# Altium project STM_BLUEPILL.PrjPcb (part 2 of 2)

## Sheet [04] - MICROCONTROLLER.SchDoc
size A3; DocumentNumber: 4; SheetNumber: 4; SheetTotal: 7
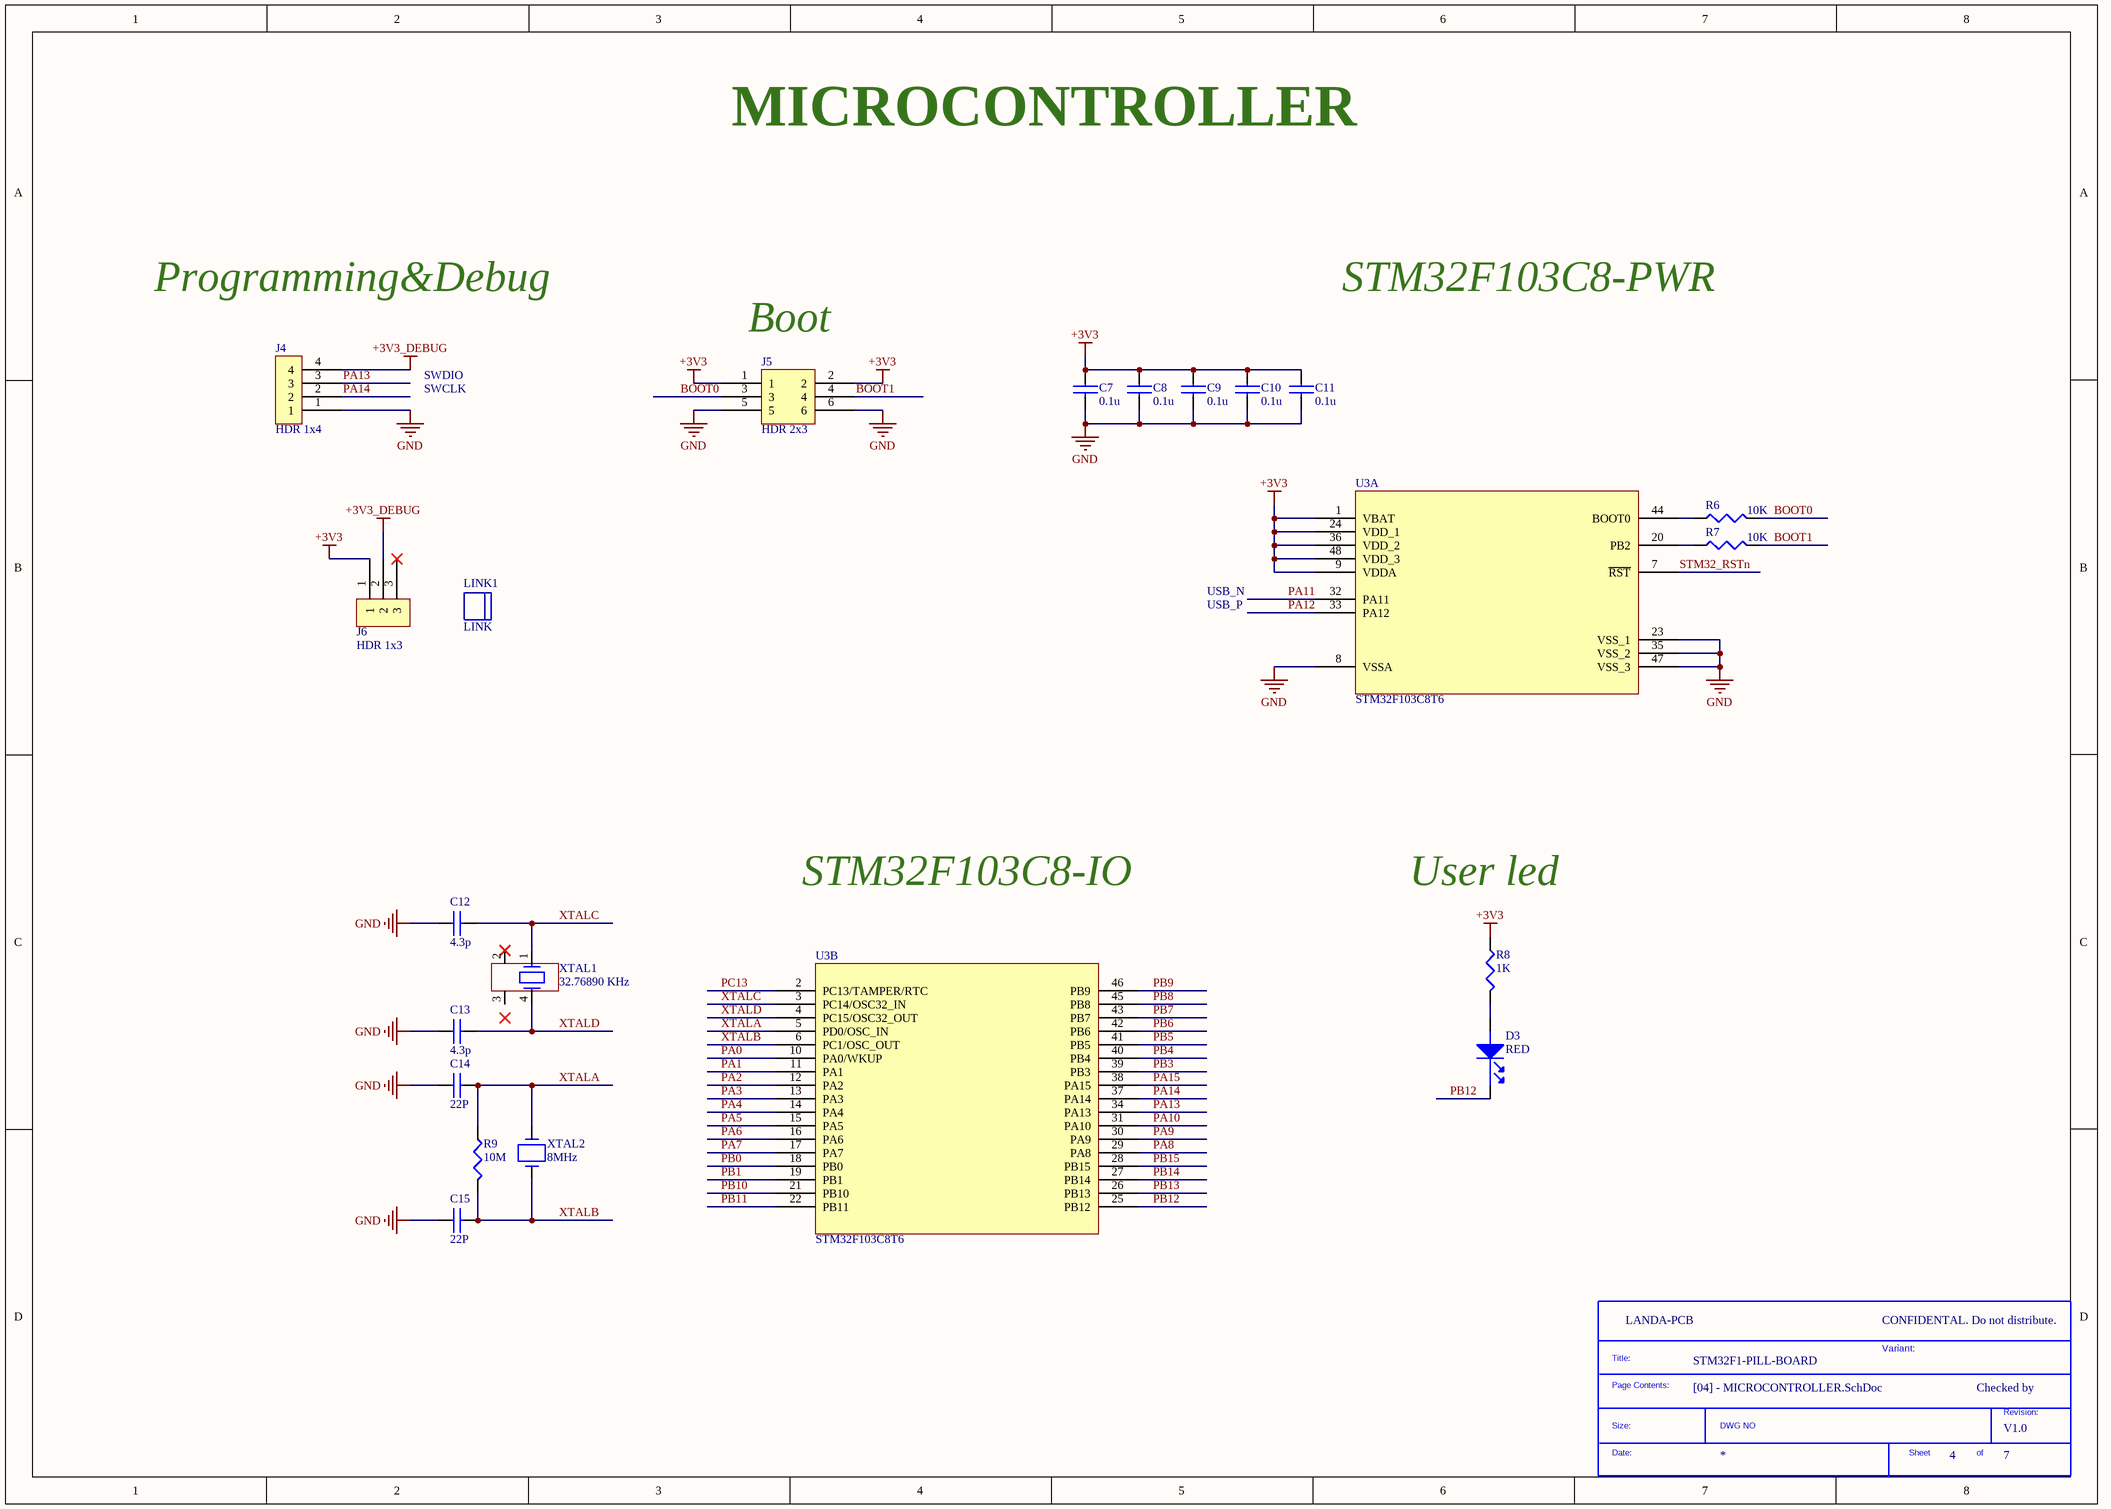
[diagram p5: [04] - MICROCONTROLLER.SchDoc]

### Parts
(Parts that share a designator on the sheet are numbered #1, #2 ... from top to bottom, then left to right.)
*#6  SDTitleBlock  (value not drawn)  (graphical)
C7  0.1u  [C0805]
C8  0.1u  [C0805]
C9  0.1u  [C0805]
C10  0.1u  [C0805]
C11  0.1u  [C0805]
C12  4.3p  [C0805]
C13  4.3p  [C0805]
C14  22P  [C0805]
C15  22P  [C0805]
D3  RED  [LED-0805]
J4  HDR 1x4  [HDR_1x4_2.54MM]
J5  HDR 2x3  [HDR_2X3_2.54MM]
J6  HDR 1x3  [Hdr_1x3_2.54mm]
LINK1  LINK  (mechanical)
R6  10K  [R0805]
R7  10K  [R0805]
R8  1K  [R0805]
R9  10M  [R0805]
U3  STM32F103C8T6  [LQFP-48]  (parts A,B of 2)
XTAL1  32.76890 KHz  [XTAL_ABS25-32.768KHZ-6-T]
XTAL2  8MHz  [XTAL_11.4mmx4.9mm]

### Nets
+3V3: C7.1 C8.1 C9.1 C10.1 C11.1 J5.1 J5.2 J6.1 R8.1 U3.1(VBAT) U3.9(VDDA) U3.24(VDD_1) U3.36(VDD_2) U3.48(VDD_3)
+3V3_DEBUG: J4.4 J6.2
GND: C7.2 C8.2 C9.2 C10.2 C11.2 C12.1 C13.1 C14.1 C15.1 J4.1 J5.5 J5.6 U3.8(VSSA) U3.23(VSS_1) U3.35(VSS_2) U3.47(VSS_3)
BOOT0: J5.3 R6.2
BOOT1: J5.4 R7.2
PA0: U3.10(PA0/WKUP)
PA1: U3.11(PA1)
PA2: U3.12(PA2)
PA3: U3.13(PA3)
PA4: U3.14(PA4)
PA5: U3.15(PA5)
PA6: U3.16(PA6)
PA7: U3.17(PA7)
PA8: U3.29(PA8)
PA9: U3.30(PA9)
PA10: U3.31(PA10)
PA11: U3.32(PA11)
PA12: U3.33(PA12)
PA13: J4.3 U3.34(PA13)
PA14: J4.2 U3.37(PA14)
PA15: U3.38(PA15)
PB0: U3.18(PB0)
PB1: U3.19(PB1)
PB3: U3.39(PB3)
PB4: U3.40(PB4)
PB5: U3.41(PB5)
PB6: U3.42(PB6)
PB7: U3.43(PB7)
PB8: U3.45(PB8)
PB9: U3.46(PB9)
PB10: U3.21(PB10)
PB11: U3.22(PB11)
PB12: D3.1(cathode) U3.25(PB12)
PB13: U3.26(PB13)
PB14: U3.27(PB14)
PB15: U3.28(PB15)
PC13: U3.2(PC13/TAMPER/RTC)
STM32_RSTn: U3.7(~{RST})
XTALA: C14.2 R9.1 U3.5(PD0/OSC_IN) XTAL2.1
XTALB: C15.2 R9.2 U3.6(PC1/OSC_OUT) XTAL2.2
XTALC: C12.2 U3.3(PC14/OSC32_IN) XTAL1.1
XTALD: C13.2 U3.4(PC15/OSC32_OUT) XTAL1.4
NetD3_2: D3.2(ANODE) R8.2
NetR6_1: R6.1 U3.44(BOOT0)
NetR7_1: R7.1 U3.20(PB2)

Not connected (* = marked no-connect by the designer): J6 3*; XTAL1 2* 3

### Notes on the sheet
- MICROCONTROLLER
- Programming&Debug
- STM32F103C8-PWR
- SWDIO
- (near J5) Boot
- SWCLK
- USB_N
- USB_P
- STM32F103C8-IO
- User led
- CONFIDENTAL. Do not distribute.
- CLOCKS (CPU & PCIE)
- Variant:
- Checked by
- (in symbol SDTitleBlock) Title:; Page Contents:; Revision:; Size:; DWG NO; Date:; Sheet; of

### Library data of the parts
C7-C11 = C2012X7R1H104K085AA: CAP CER 0.1UF 50V 10% X7R 0805; Manufacturer: TDK; Dielectric Material: Ceramic; Capacitance: 100nF; Supplier 1: Digi-Key; Manufacturer Part Number: C2012X7R1H104K085AA; Stock 1: 151003; Pricing 1: 1 = 0.17000, 10 = 0.11900, 100 = 0.05610, 500 = 0.03936, 1000 = 0.03258 (USD); RoHS: Yes; Mount: Surface Mount; Case/Package: 0805; Number of Pins: 2; Weight: 0.000194oz; Case Code (Metric): 2012; Case Code (Imperial): 0805; Min Operating Temperature: -55°C; Max Operating Temperature: 125°C; Tolerance: 10%; Dielectric: X7R; Termination: SMD/SMT; Voltage Rating: 50V; Packaging: Tape and Reel; Voltage Rating (DC): 50V; Composition: Ceramic; Voltage: 50V; Package Quantity: 1; Length: 2mm; Height: 0.85mm; Depth: 1.25mm; Thickness: 0.037inch; Width: 0.049inch; Radiation Hardening: No; Lead Free: Lead Free; REACH SVHC: No SVHC; ComponentLink1URL: https://datasheet.ciiva.com/11788/0900766b80c1bb00-11788128.pdf?src-supplier=RSComponents; ComponentLink1Description: https://datasheet.ciiva.com/11788/0900766b80c1bb00-11788128.pdf?src-supplier=RSComponents; ComponentLink2URL: https://datasheet.ciiva.com/6250/tdkmlcccaprange-6250821.pdf?src-supplier=Digi-Key; ComponentLink2Description: https://datasheet.ciiva.com/6250/tdkmlcccaprange-6250821.pdf?src-supplier=Digi-Key; ComponentLink3URL: https://datasheet.ciiva.com/24191/e412-c-24191447.pdf?src-supplier=Future+Electronics; ComponentLink3Description: https://datasheet.ciiva.com/24191/e412-c-24191447.pdf?src-supplier=Future+Electronics; ComponentLink4URL: https://datasheet.ciiva.com/6250/tdkmlcccaprange-6250824.pdf?src-supplier=Digi-Key; ComponentLink4Description: https://datasheet.ciiva.com/6250/tdkmlcccaprange-6250824.pdf?src-supplier=Digi-Key; ComponentLink5URL: https://datasheet.ciiva.com/23803/1796654-23803035.pdf?src-supplier=Newark; ComponentLink5Description: https://datasheet.ciiva.com/23803/1796654-23803035.pdf?src-supplier=Newark; ComponentLink6URL: https://datasheet.ciiva.com/28602/1571323-28602204.pdf?src-supplier=Element14; ComponentLink6Description: https://datasheet.ciiva.com/28602/1571323-28602204.pdf?src-supplier=Element14; Supplier Part Number 1: 445-7534-1-ND
C12 C13 = 08055A4R3CAT2A: CAP CER 4.3PF 50V NP0 0805; Manufacturer: Kyocera AVX; Dielectric: C0G; Supplier 1: Mouser; Manufacturer Part Number: 08055A4R3CAT2A; Stock 1: 7147; Pricing 1: 1 = 0.24000, 10 = 0.16700, 100 = 0.09500, 500 = 0.06700, 1000 = 0.05800, 2000 = 0.04800 (USD); RoHS: Yes; Mount: Surface Mount; Case/Package: 0805; Case Code (Metric): 2012; Case Code (Imperial): 0805; Min Operating Temperature: -55°C; Max Operating Temperature: 125°C; Termination: SMD/SMT; Package Quantity: 4000; Capacitance: 4.3pF; Voltage Rating: 50V; Packaging: Tape and Reel; Voltage Rating (DC): 50V; Length: 2.01mm; Height: 0.94mm; Thickness: 0.037inch; Depth: 1.25mm; Width: 0.049inch; Radiation Hardening: No; ComponentLink1URL: https://datasheet.ciiva.com/11571/ccog-11571222.pdf?src-supplier=Avnet; ComponentLink1Description: https://datasheet.ciiva.com/11571/ccog-11571222.pdf?src-supplier=Avnet; ComponentLink2URL: https://datasheet.ciiva.com/204/ccog-204993.pdf?src-supplier=Digi-Key; ComponentLink2Description: https://datasheet.ciiva.com/204/ccog-204993.pdf?src-supplier=Digi-Key; Supplier Part Number 1: 581-08055A4R3CAT2A
C14 C15 = C0805C220J5GACTU: CAP CER 22pF 50VDC C0G ±5% 0805; Manufacturer: KEMET; Dielectric Material: Ceramic; Temperature Coefficient: 30ppm/°C; Voltage Rating: 50V; Supplier 1: Mouser; Manufacturer Part Number: C0805C220J5GACTU; Stock 1: 168597; Pricing 1: 1 = 0.10000, 10 = 0.06300, 100 = 0.03100, 500 = 0.02200, 1000 = 0.01700, 4000 = 0.01200 (USD); RoHS: Yes; Mount: PCB,Surface Mount; Case/Package: 0805; Weight: 0.000194oz; Case Code (Metric): 2012; Case Code (Imperial): 0805; Contact Plating: Tin,Matte; Contact Material: Tin; Min Operating Temperature: -55°C; Max Operating Temperature: 125°C; Dielectric: C0G; Packaging: Tape and Reel; Capacitance: 22pF; Tolerance: 5%; Package Quantity: 1; Voltage Rating (DC): 50V; Termination: SMD/SMT; Voltage: 50V; Length: 2mm; Height: 0.78mm; Width: 1.25mm; Thickness: 0.035inch; Depth: 1.25mm; Radiation Hardening: No; Lead Free: Lead Free; REACH SVHC: No SVHC; ComponentLink1URL: https://datasheet.ciiva.com/7842/1732694-7842250.pdf?src-supplier=Element14; ComponentLink1Description: https://datasheet.ciiva.com/7842/1732694-7842250.pdf?src-supplier=Element14; ComponentLink2URL: https://datasheet.ciiva.com/28668/1789732-28668761.pdf?src-supplier=Element14; ComponentLink2Description: https://datasheet.ciiva.com/28668/1789732-28668761.pdf?src-supplier=Element14; ComponentLink3URL: https://datasheet.ciiva.com/7842/1372242-7842570.pdf?src-supplier=Element14; ComponentLink3Description: https://datasheet.ciiva.com/7842/1372242-7842570.pdf?src-supplier=Element14; Supplier Part Number 1: 80-C0805C220J5G
D3 = LTST-C170EKT: LED RED 630NM 0805; Manufacturer: Vishay Lite-On; Lens Color: Colorless; Test Current: 10mA; Luminous Intensity: 2mcd; Viewing Angle: 130°; Forward Voltage: 2V; Dominant Wavelength: 621nm; Lens Transparency: Clear; Reverse Voltage: 5V; Number of Elements: 1; Power Dissipation: 100mW; Forward Current: 30mA; Lens Style: Diffused,Colorless,Rectangular,Clear; Supplier 1: Mouser; Manufacturer Part Number: LTST-C170EKT; Stock 1: 11147; Pricing 1: 1 = 0.33000, 10 = 0.18000, 100 = 0.08300, 1000 = 0.06100, 3000 = 0.05200, 9000 = 0.04700, 24000 = 0.04100, 45000 = 0.03800, 99000 = 0.03500 (USD); RoHS: Yes; Mount: Surface Mount; Case/Package: 0805; Number of Pins: 2; Color: Red; Case Code (Imperial): 0805; Case Code (Metric): 2012; Min Operating Temperature: -55°C; Max Operating Temperature: 85°C; Wavelength: 630nm; Packaging: Tape and Reel; Package Quantity: 1; Number of LEDs: 1; Illumination Color: Red; Power Rating: 100mW; Voltage: 5V; Length: 2mm; Height: 1.1mm; Width: 1.25mm; Depth: 1.25mm; Radiation Hardening: No; Lead Free: Lead Free; ComponentLink1URL: https://datasheet.ciiva.com/2110/ltst-c170ekt-2110099.pdf?src-supplier=Digi-Key; ComponentLink1Description: https://datasheet.ciiva.com/2110/ltst-c170ekt-2110099.pdf?src-supplier=Digi-Key; ComponentLink2URL: https://datasheet.ciiva.com/15117/getdatasheetpartid-147507-15117859.pdf?src-supplier=Verical; ComponentLink2Description: https://datasheet.ciiva.com/15117/getdatasheetpartid-147507-15117859.pdf?src-supplier=Verical; ComponentLink3URL: https://datasheet.ciiva.com/11775/0900766b80dc0277-11775641.pdf?src-supplier=RSComponents; ComponentLink3Description: https://datasheet.ciiva.com/11775/0900766b80dc0277-11775641.pdf?src-supplier=RSComponents; ComponentLink4URL: https://datasheet.ciiva.com/19482/1260314-19482330.pdf?src-supplier=Jameco; ComponentLink4Description: https://datasheet.ciiva.com/19482/1260314-19482330.pdf?src-supplier=Jameco; ComponentLink5URL: https://datasheet.ciiva.com/16202/lite-on20ltst-c170ekt-16202383.pdf?src-supplier=Future+Electronics; ComponentLink5Description: https://datasheet.ciiva.com/16202/lite-on20ltst-c170ekt-16202383.pdf?src-supplier=Future+Electronics; ComponentLink6URL: https://datasheet.ciiva.com/2110/ltst-c170ekt-2110100.pdf?src-supplier=Digi-Key; ComponentLink6Description: https://datasheet.ciiva.com/2110/ltst-c170ekt-2110100.pdf?src-supplier=Digi-Key; ComponentLink7URL: https://datasheet.ciiva.com/2110/ltst-c170ekt-2110101.pdf?src-supplier=Digi-Key; ComponentLink7Description: https://datasheet.ciiva.com/2110/ltst-c170ekt-2110101.pdf?src-supplier=Digi-Key; Supplier Part Number 1: 859-LTST-C170EKT
J4 = 68001-204HLF: CONN HEADER VERT 4POS 2.54MM; Manufacturer: Amphenol FCI; Current Rating: 3A; Voltage Rating: 1.5kV; Connector Type: Male Pin; Gender: Male; Number of Positions: 4; Insulation Resistance: 5GR; Contact Post Length: 3.05mm; Supplier 1: Digi-Key; Manufacturer Part Number: 68001-204HLF; Stock 1: 3842; Pricing 1: 1 = 0.38000, 10 = 0.35700, 100 = 0.25010, 500 = 0.21442, 1000 = 0.17868, 5000 = 0.15315, 10000 = 0.14294 (USD); RoHS: Yes; Mount: Through Hole; Color: Black; Contact Plating: Gold,GXT; Contact Material: Bronze; Housing Material: Thermoplastic; Min Operating Temperature: -65°C; Max Operating Temperature: 125°C; Package Quantity: 100; Number of Rows: 1; Packaging: Bulk; Contact Gender: Male; Termination: Solder; Number of Contacts: 4; Orientation: Straight; Pitch: 2.54mm; Contact Mating Length: 0.23inch; Radiation Hardening: No; Flammability Rating: UL94 V-0; ComponentLink1URL: https://datasheet.ciiva.com/5164/68000-274255-5164127.pdf?src-supplier=Mouser; ComponentLink1Description: https://datasheet.ciiva.com/5164/68000-274255-5164127.pdf?src-supplier=Mouser; ComponentLink2URL: https://datasheet.ciiva.com/726/68000-726529.pdf?src-supplier=Digi-Key; ComponentLink2Description: https://datasheet.ciiva.com/726/68000-726529.pdf?src-supplier=Digi-Key; Supplier Part Number 1: 609-3402-ND
J5 = 67997-106HLF: CONN HEADER 6POS .100 STR 30AU; Manufacturer: Amphenol FCI; Number of Contacts: 6; Insulation Resistance: 5GR; Max Voltage Rating (AC): 1.5kV; Gender: Male; Current Rating: 3A; Connector Type: Male Pin; Pitch: 2.54mm; Row Spacing: 0.1inch; Contact Post Length: 3.05mm; Supplier 1: Mouser; Manufacturer Part Number: 67997-106HLF; Stock 1: 1840; Pricing 1: 1 = 1.78000, 10 = 1.55000, 100 = 1.38000, 200 = 1.33000, 500 = 1.15000, 1000 = 0.94100 (USD); RoHS: Yes; Mount: Through Hole; Contact Plating: Gold,GXT; Housing Color: Black; Contact Material: Bronze; Color: Black; Housing Material: Thermoplastic; Min Operating Temperature: -65°C; Max Operating Temperature: 125°C; Termination: Through Hole; Number of Rows: 2; Orientation: Straight; Number of Positions: 6; Packaging: Bulk; Package Quantity: 100; Contact Gender: Male; Voltage Rating: 1.5kV; Length: 7.62mm; Contact Mating Length: 0.23inch; Depth: 4.83mm; Radiation Hardening: No; Lead Free: Lead Free; REACH SVHC: No SVHC; Flammability Rating: UL94 V-0; ComponentLink1URL: https://datasheet.ciiva.com/5153/67996-222463-5153820.pdf?src-supplier=Mouser; ComponentLink1Description: https://datasheet.ciiva.com/5153/67996-222463-5153820.pdf?src-supplier=Mouser; ComponentLink2URL: https://datasheet.ciiva.com/10149/67996-10149221.pdf?src-supplier=Avnet; ComponentLink2Description: https://datasheet.ciiva.com/10149/67996-10149221.pdf?src-supplier=Avnet; ComponentLink3URL: https://datasheet.ciiva.com/46393/1876884-46393067.pdf?src-supplier=Element14; ComponentLink3Description: https://datasheet.ciiva.com/46393/1876884-46393067.pdf?src-supplier=Element14; ComponentLink4URL: https://datasheet.ciiva.com/722/67996-722044.pdf?src-supplier=Digi-Key; ComponentLink4Description: https://datasheet.ciiva.com/722/67996-722044.pdf?src-supplier=Digi-Key; ComponentLink5URL: https://datasheet.ciiva.com/16726/67996-16726286.pdf?src-supplier=Avnet+Europe; ComponentLink5Description: https://datasheet.ciiva.com/16726/67996-16726286.pdf?src-supplier=Avnet+Europe; Supplier Part Number 1: 649-67997-106HLF
J6 = 68000-103HLF: HDR 3 POS 2.54MM STRAIGHT; Manufacturer: Amphenol FCI; Number of Positions: 3; Connector Type: Male Pin; Current Rating: 3A; Voltage Rating: 1.5kV; Insulation Resistance: 5GR; Gender: Male; Contact Post Length: 2.41mm; Supplier 1: Mouser; Manufacturer Part Number: 68000-103HLF; Stock 1: 38196; Pricing 1: 1 = 0.29000, 10 = 0.23300, 100 = 0.16700, 1000 = 0.13900, 2500 = 0.11300, 10000 = 0.11300 (USD); RoHS: Yes; Mount: Through Hole; Contact Plating: Gold,GXT; Contact Material: Bronze; Color: Black; Housing Color: Black; Housing Material: Thermoplastic; Min Operating Temperature: -65°C; Max Operating Temperature: 125°C; Number of Rows: 1; Termination: Through Hole; Packaging: Bulk; Number of Contacts: 3; Contact Gender: Male; Package Quantity: 100; Max Voltage Rating (AC): 1.5kV; Orientation: Straight; Length: 7.62mm; Pitch: 2.54mm; Contact Mating Length: 5.84mm; Depth: 2.41mm; Radiation Hardening: No; Flammability Rating: UL94 V-0; REACH SVHC: No SVHC; ComponentLink1URL: https://datasheet.ciiva.com/5157/68000-274283-5157301.pdf?src-supplier=Mouser; ComponentLink1Description: https://datasheet.ciiva.com/5157/68000-274283-5157301.pdf?src-supplier=Mouser; ComponentLink2URL: https://datasheet.ciiva.com/46392/1914865-46392021.pdf?src-supplier=Element14; ComponentLink2Description: https://datasheet.ciiva.com/46392/1914865-46392021.pdf?src-supplier=Element14; ComponentLink3URL: https://datasheet.ciiva.com/10149/68000-10149754.pdf?src-supplier=Avnet; ComponentLink3Description: https://datasheet.ciiva.com/10149/68000-10149754.pdf?src-supplier=Avnet; Supplier Part Number 1: 649-68000-103HLF
LINK1 = QPC02SXGN-RC: CONN JUMPER SHORTING .100" GOLD; Manufacturer: Sullins Connector Solutions; Gender: Female Sockets; Number of Positions or Pins (Grid): 2 (1 x 2); Pitch: 0.100" (2.54mm); .Checked SCH: used; Supplier 1: Digi-Key; Supplier Part Number 1: S9337-ND; Manufacturer Part Number: QPC02SXGN-RC; RoHS: RoHS Compliant; Category: Connectors, Interconnects; Stock 1: 23274; Pricing 1: 1=0.11, 10=0.066, 25=0.0468, 50=0.0384, 100=0.033, 250=0.02792, 500=0.0258, 1000=0.0228, 2500=0.018 (USD); Type: Open Top; Height: 0.235" (5.97mm); Contact Finish: Gold; Contact Finish Thickness: Flash; Color: -; Packaging: Bulk; ComponentLink1URL: http://www.sullinscorp.com/drawings/284_SXGN_11510.pdf; ComponentLink1Description: http://www.sullinscorp.com/drawings/284_SXGN_11510.pdf
R6 R7 = RC0805FR-0710KL: RES 10K OHM 1% 1/8W 0805; Manufacturer: Yageo; Temperature Coefficient: 100ppm/°C; Resistance: 10kR; Power Rating: 125mW; Voltage Rating: 150V; Supplier 1: Mouser; Manufacturer Part Number: RC0805FR-0710KL; Stock 1: 468; Pricing 1: 1 = 0.13000, 10 = 0.03100, 100 = 0.01100, 1000 = 0.00800, 5000 = 0.00500, 10000 = 0.00500 (USD); RoHS: Yes; Case/Package: 0805; Case Code (Imperial): 0805; Case Code (Metric): 2012; Min Operating Temperature: -55°C; Max Operating Temperature: 155°C; Composition: Thick Film; Tolerance: 1%; Packaging: Tape and Reel; Features: Moisture Resistant; Termination: SMD/SMT; Number of Terminations: 2; Military Standard: Not; Max Power Dissipation: 125mW; Package Quantity: 1; Length: 2mm; Height: 0.024inch; Width: 0.049inch; Depth: 1.25mm; Lead Free: Lead Free; REACH SVHC: Unknown; ComponentLink1URL: https://datasheet.ciiva.com/11808/0900766b8106beab-11808151.pdf?src-supplier=RSComponents; ComponentLink1Description: https://datasheet.ciiva.com/11808/0900766b8106beab-11808151.pdf?src-supplier=RSComponents; ComponentLink2URL: https://datasheet.ciiva.com/12669/rc0805-12669688.pdf?src-supplier=Mouser; ComponentLink2Description: https://datasheet.ciiva.com/12669/rc0805-12669688.pdf?src-supplier=Mouser; ComponentLink3URL: https://datasheet.ciiva.com/46447/444164-46447563.pdf?src-supplier=Element14; ComponentLink3Description: https://datasheet.ciiva.com/46447/444164-46447563.pdf?src-supplier=Element14; ComponentLink4URL: https://datasheet.ciiva.com/2456/pyu-r-int-thick-7-2456972.pdf?src-supplier=Digi-Key; ComponentLink4Description: https://datasheet.ciiva.com/2456/pyu-r-int-thick-7-2456972.pdf?src-supplier=Digi-Key; ComponentLink5URL: https://datasheet.ciiva.com/2456/pyu-r-int-thick-7-2456973.pdf?src-supplier=Digi-Key; ComponentLink5Description: https://datasheet.ciiva.com/2456/pyu-r-int-thick-7-2456973.pdf?src-supplier=Digi-Key; ComponentLink6URL: https://datasheet.ciiva.com/2456/pyu-r-int-thick-7-2456974.pdf?src-supplier=Digi-Key; ComponentLink6Description: https://datasheet.ciiva.com/2456/pyu-r-int-thick-7-2456974.pdf?src-supplier=Digi-Key; ComponentLink7URL: https://datasheet.ciiva.com/16747/rc0805-16747087.pdf?src-supplier=Future+Electronics; ComponentLink7Description: https://datasheet.ciiva.com/16747/rc0805-16747087.pdf?src-supplier=Future+Electronics; Supplier Part Number 1: 603-RC0805FR-0710KL
R8 = RC0805FR-071KL: RES 1K OHM 1% 1/8W 0805; Manufacturer: Yageo; Temperature Coefficient: 100ppm/°C; Resistance: 1kR; Voltage Rating (DC): 150V; Power Rating: 125mW; Supplier 1: Mouser; Manufacturer Part Number: RC0805FR-071KL; Stock 1: 2067955; Pricing 1: 1 = 0.13000, 10 = 0.03100, 100 = 0.01100, 1000 = 0.00800, 5000 = 0.00500, 10000 = 0.00500 (USD); RoHS: Yes; Case/Package: 0805; Number of Pins: 2; Case Code (Metric): 2012; Case Code (Imperial): 0805; Min Operating Temperature: -55°C; Max Operating Temperature: 155°C; Tolerance: 1%; Packaging: Tape and Reel; Composition: Thick Film; Features: Moisture Resistant; Max Power Dissipation: 125mW; Package Quantity: 1; Voltage Rating: 150V; Number of Terminations: 2; Termination: SMD/SMT; Military Standard: Not; Length: 0.079inch; Height: 0.024inch; Width: 0.049inch; Depth: 1.25mm; Lead Free: Lead Free; REACH SVHC: Unknown; ComponentLink1URL: https://datasheet.ciiva.com/2456/pyu-r-int-thick-7-2456976.pdf?src-supplier=Digi-Key; ComponentLink1Description: https://datasheet.ciiva.com/2456/pyu-r-int-thick-7-2456976.pdf?src-supplier=Digi-Key; ComponentLink2URL: https://datasheet.ciiva.com/2456/pyu-r-int-thick-7-2456977.pdf?src-supplier=Digi-Key; ComponentLink2Description: https://datasheet.ciiva.com/2456/pyu-r-int-thick-7-2456977.pdf?src-supplier=Digi-Key; ComponentLink3URL: https://datasheet.ciiva.com/16850/rc0805-16850409.pdf?src-supplier=Future+Electronics; ComponentLink3Description: https://datasheet.ciiva.com/16850/rc0805-16850409.pdf?src-supplier=Future+Electronics; ComponentLink4URL: https://datasheet.ciiva.com/46385/444164-46385020.pdf?src-supplier=Element14; ComponentLink4Description: https://datasheet.ciiva.com/46385/444164-46385020.pdf?src-supplier=Element14; ComponentLink5URL: https://datasheet.ciiva.com/7941/1686128-7941719.pdf?src-supplier=Element14; ComponentLink5Description: https://datasheet.ciiva.com/7941/1686128-7941719.pdf?src-supplier=Element14; ComponentLink6URL: https://datasheet.ciiva.com/2456/pyu-r-int-thick-7-2456975.pdf?src-supplier=Digi-Key; ComponentLink6Description: https://datasheet.ciiva.com/2456/pyu-r-int-thick-7-2456975.pdf?src-supplier=Digi-Key; Supplier Part Number 1: 603-RC0805FR-071KL
R9 = KTR10EZPF1005: RES 10M Ohm 1% 1/8W 0805; Manufacturer: Rohm; Resistance: 10MR; Max Power Dissipation: 125mW; Temperature Coefficient: 100ppm/°C; Supplier 1: Mouser; Manufacturer Part Number: KTR10EZPF1005; Stock 1: 48493; Pricing 1: 1 = 0.17000, 10 = 0.15500, 100 = 0.05500, 1000 = 0.03700, 5000 = 0.02800, 10000 = 0.02400 (USD); RoHS: Yes; Case/Package: 0805; Case Code (Imperial): 0805; Case Code (Metric): 2012; Min Operating Temperature: -55°C; Max Operating Temperature: 155°C; Composition: Thick Film; Features: Automotive AEC-Q200; Packaging: Tape and Reel; Tolerance: 1%; Number of Terminations: 2; ComponentLink1URL: http://www.farnell.com/datasheets/2369963.pdf?src-supplier=Farnell; ComponentLink1Description: http://www.farnell.com/datasheets/2369963.pdf?src-supplier=Farnell; ComponentLink2URL: https://www.rohm.com/datasheet/KTR03EZPF/ktr-e?src-supplier=Digi-Key; ComponentLink2Description: https://www.rohm.com/datasheet/KTR03EZPF/ktr-e?src-supplier=Digi-Key; ComponentLink3URL: http://www.farnell.com/datasheets/2369963.pdf?src-supplier=Newark; ComponentLink3Description: http://www.farnell.com/datasheets/2369963.pdf?src-supplier=Newark; Supplier Part Number 1: 755-KTR10EZPF1005
U3 = STM32F103C8T6: STM32F103C8T6 - ARM MCU Cortex-M3, 32bit, 72 MHz; Manufacturer: STMicroelectronics; RAM Size: 20KB; Frequency: 72MHz; Memory Size: 64KB; Watchdog Timer: Yes; Peripherals: POR,PWM,WDT,DMA,Temp Sensor,I2C; Max Power Dissipation: 363mW; Interface: I2C,SPI,USB,CAN,IrDA,UART,USART,LIN; Number of I/Os: 37; Number of Timers/Counters: 4; Max Supply Voltage: 3.6V; Number of ADC Channels: 10; Min Supply Voltage: 2V; Oscillator Type: Internal; Number of Programmable I/O: 48; Data Bus Width: 32b; Number of Bits: 32; Memory Type: FLASH; Number of PWM Channels: 1; Number of SPI Channels: 2; Supplier 1: Mouser; Manufacturer Part Number: STM32F103C8T6; Stock 1: 2184; Pricing 1: 1 = 5.74000, 10 = 4.88000, 100 = 4.23000, 250 = 4.01000, 500 = 3.60000, 1000 = 3.03000, 2500 = 2.88000, 5000 = 2.77000, 10000 = 2.60000 (USD); RoHS: Yes; Case/Package: LQFP; Number of Pins: 48; Min Operating Temperature: -40°C; Max Operating Temperature: 85°C; Packaging: Tray; Core Architecture: ARM; Package Quantity: 250; Density: 64KB; Max Frequency: 72MHz; Termination: SMD/SMT; Number of I2C Channels: 2; Address Bus Width: 32b; Length: 7mm; Height: 1.45mm; Width: 7.2mm; Radiation Hardening: No; Lead Free: Lead Free; REACH SVHC: No SVHC; ComponentLink1URL: https://datasheet.ciiva.com/15122/getdatasheetpartid-69880-15122076.pdf?src-supplier=Verical; ComponentLink1Description: https://datasheet.ciiva.com/15122/getdatasheetpartid-69880-15122076.pdf?src-supplier=Verical; ComponentLink2URL: https://datasheet.ciiva.com/26816/stm32f103c8t6-26816902.pdf?src-supplier=IIIC; ComponentLink2Description: https://datasheet.ciiva.com/26816/stm32f103c8t6-26816902.pdf?src-supplier=IIIC; ComponentLink3URL: https://datasheet.ciiva.com/16210/cd00161566-16210248.pdf?src-supplier=Future+Electronics; ComponentLink3Description: https://datasheet.ciiva.com/16210/cd00161566-16210248.pdf?src-supplier=Future+Electronics; ComponentLink4URL: https://datasheet.ciiva.com/14100/pustm-arm-microcont-stm32f103-en-14100508.pdf?src-supplier=Distrelec; ComponentLink4Description: https://datasheet.ciiva.com/14100/pustm-arm-microcont-stm32f103-en-14100508.pdf?src-supplier=Distrelec; ComponentLink5URL: https://datasheet.ciiva.com/8054/1730126-8054942.pdf?src-supplier=Element14; ComponentLink5Description: https://datasheet.ciiva.com/8054/1730126-8054942.pdf?src-supplier=Element14; ComponentLink6URL: https://datasheet.ciiva.com/48687/001075658-da-01-en-mcu-64kb-mem-stm32f103c8t6-lqfp-48-stm-48687589.pdf?src-supplier=Conrad; ComponentLink6Description: https://datasheet.ciiva.com/48687/001075658-da-01-en-mcu-64kb-mem-stm32f103c8t6-lqfp-48-stm-48687589.pdf?src-supplier=Conrad; Supplier Part Number 1: 511-STM32F103C8T6
XTAL1 = ABS25-32.768KHZ-6-T: XTAL 32.7680KHZ 6PF SMD; Manufacturer: Abracon; Frequency Tolerance: 20ppm; ESR (Equivalent Series Resistance): 50kR; Insulation Resistance: 500MR; Supplier 1: Mouser; Manufacturer Part Number: ABS25-32.768KHZ-6-T; Stock 1: 23277; Pricing 1: 1 = 0.60000, 10 = 0.50700, 50 = 0.45500, 100 = 0.40500, 500 = 0.38600, 1000 = 0.30800 (USD); RoHS: Yes; Mount: Surface Mount; Case/Package: SMD/SMT; Number of Pins: 4; Min Operating Temperature: -40°C; Max Operating Temperature: 85°C; Package Quantity: 3000; Frequency: 32.768kHz; Load Capacitance: 6pF; Packaging: Tape and Reel; Tolerance: 20ppm; Termination: SMD/SMT; Series Resistance: 50kR; Length: 8.7mm; Height: 0.098inch; Width: 0.15inch; Depth: 3.8mm; Radiation Hardening: No; Lead Free: Lead Free; REACH SVHC: No SVHC; ComponentLink1URL: https://datasheet.ciiva.com/854/abs25-854528.pdf?src-supplier=Digi-Key; ComponentLink1Description: https://datasheet.ciiva.com/854/abs25-854528.pdf?src-supplier=Digi-Key; ComponentLink2URL: https://datasheet.ciiva.com/26909/getdatasheetpartid-722397-26909970.pdf?src-supplier=Verical; ComponentLink2Description: https://datasheet.ciiva.com/26909/getdatasheetpartid-722397-26909970.pdf?src-supplier=Verical; ComponentLink3URL: https://datasheet.ciiva.com/5788/abs25-5788102.pdf?src-supplier=Farnell; ComponentLink3Description: https://datasheet.ciiva.com/5788/abs25-5788102.pdf?src-supplier=Farnell; ComponentLink4URL: https://datasheet.ciiva.com/854/abs25-854527.pdf?src-supplier=Digi-Key; ComponentLink4Description: https://datasheet.ciiva.com/854/abs25-854527.pdf?src-supplier=Digi-Key; ComponentLink5URL: https://datasheet.ciiva.com/854/abs25-854529.pdf?src-supplier=Digi-Key; ComponentLink5Description: https://datasheet.ciiva.com/854/abs25-854529.pdf?src-supplier=Digi-Key; ComponentLink6URL: https://datasheet.ciiva.com/7998/1856019-7998662.pdf?src-supplier=Element14; ComponentLink6Description: https://datasheet.ciiva.com/7998/1856019-7998662.pdf?src-supplier=Element14; ComponentLink7URL: https://datasheet.ciiva.com/1357/1856019-1357324.pdf?src-supplier=Element14; ComponentLink7Description: https://datasheet.ciiva.com/1357/1856019-1357324.pdf?src-supplier=Element14; Supplier Part Number 1: 815-ABS25-32.768K6-T
XTAL2 = LFXTAL050985BULK: XTAL 8MHZ SMD; Manufacturer: IQD; Supplier 1: Mouser; Manufacturer Part Number: LFXTAL050985BULK; Stock 1: 58; Pricing 1: 1 = 0.59000, 10 = 0.44500, 100 = 0.33300, 200 = 0.29000, 500 = 0.29000, 1000 = 0.28900 (USD); RoHS: No; Supplier Part Number 1: 449-LFXTAL050985BULK

## Sheet [05] - CONNECTORS.SchDoc
size A3; DocumentNumber: 5; SheetNumber: 5; SheetTotal: 7
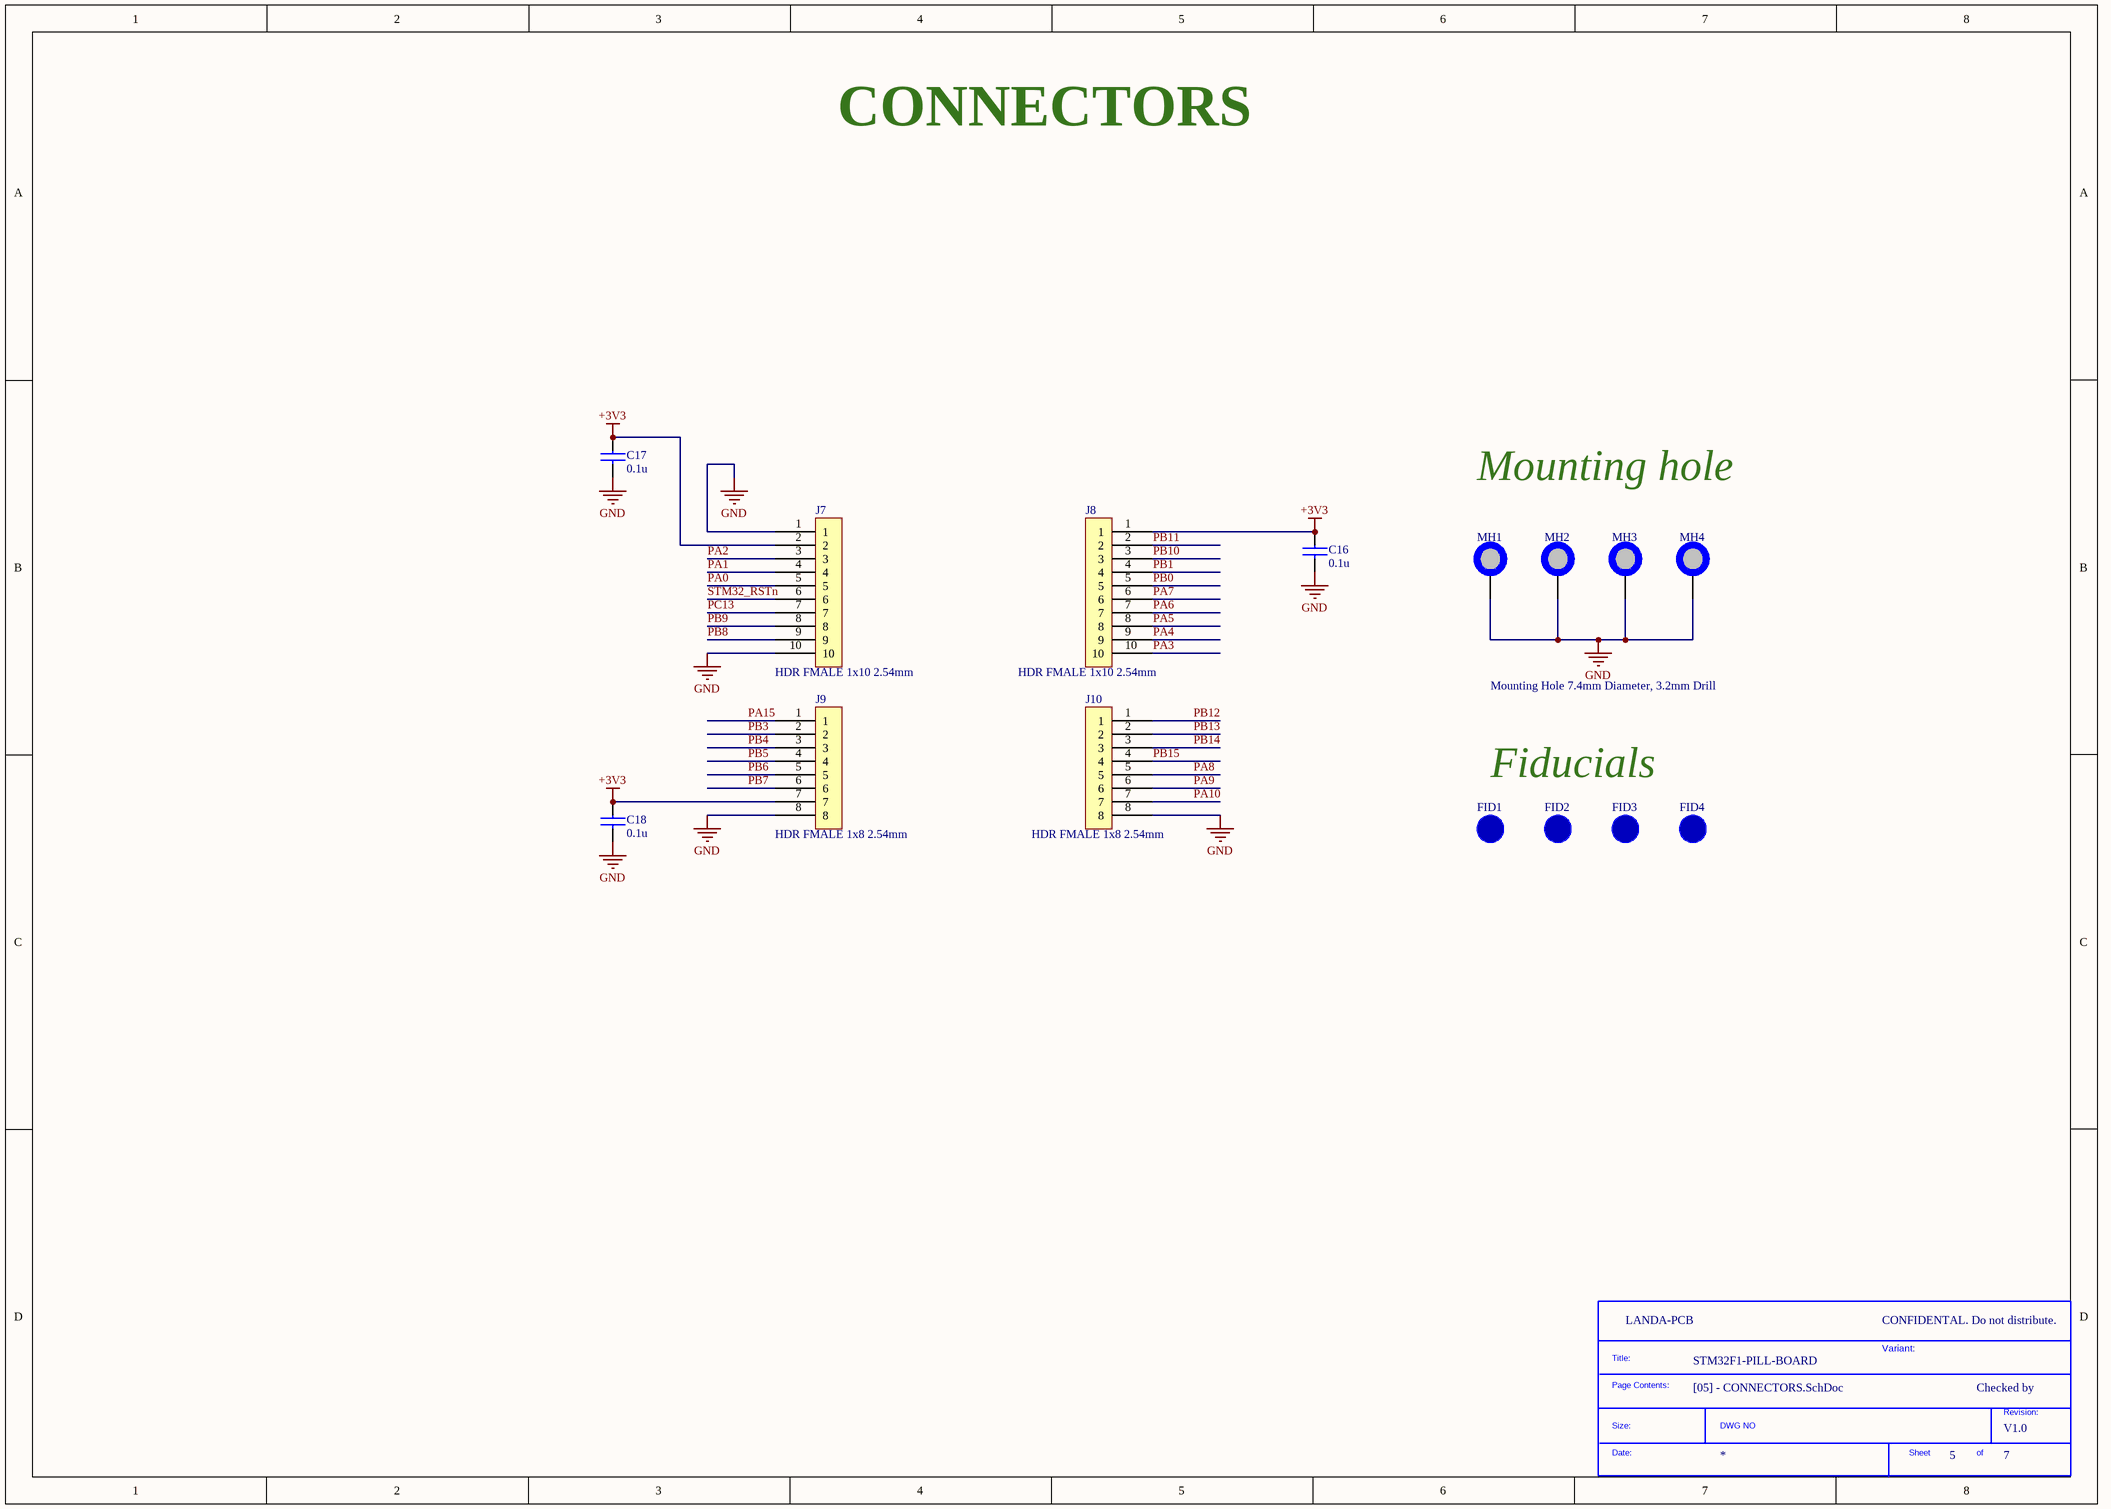
[diagram p6: [05] - CONNECTORS.SchDoc]

### Parts
(Parts that share a designator on the sheet are numbered #1, #2 ... from top to bottom, then left to right.)
*#7  SDTitleBlock  (value not drawn)  (graphical)
C16  0.1u  [C0805]
C17  0.1u  [C0805]
C18  0.1u  [C0805]
FID1  FID_1MMC  [FID_40X120D]  (value not drawn)
FID2  FID_1MMC  [FID_40X120D]  (value not drawn)
FID3  FID_1MMC  [FID_40X120D]  (value not drawn)
FID4  FID_1MMC  [FID_40X120D]  (value not drawn)
J7  HDR FMALE 1x10 2.54mm  [Hdr_Female_1x10_2.54mm]
J8  HDR FMALE 1x10 2.54mm  [Hdr_Female_1x10_2.54mm]
J9  HDR FMALE 1x8 2.54mm  [Hdr_Female_1x8_2.54mm]
J10  HDR FMALE 1x8 2.54mm  [Hdr_Female_1x8_2.54mm]
MH1  Mounting Hole 7.4mm Diameter, 3.2mm Drill  [MH_7.4MMD_3.2MMD]  (no BOM)
MH2  Mounting Hole 7.4mm Diameter, 3.2mm Drill  [MH_7.4MMD_3.2MMD]  (value not drawn)  (no BOM)
MH3  Mounting Hole 7.4mm Diameter, 3.2mm Drill  [MH_7.4MMD_3.2MMD]  (value not drawn)  (no BOM)
MH4  Mounting Hole 7.4mm Diameter, 3.2mm Drill  [MH_7.4MMD_3.2MMD]  (value not drawn)  (no BOM)

### Nets
+3V3: C16.1 C17.1 C18.1 J7.2 J8.1 J9.7
GND: C16.2 C17.2 C18.2 J7.1 J7.10 J9.8 J10.8 MH1.1 MH2.1 MH3.1 MH4.1
PA0: J7.5
PA1: J7.4
PA2: J7.3
PA3: J8.10
PA4: J8.9
PA5: J8.8
PA6: J8.7
PA7: J8.6
PA8: J10.5
PA9: J10.6
PA10: J10.7
PA15: J9.1
PB0: J8.5
PB1: J8.4
PB3: J9.2
PB4: J9.3
PB5: J9.4
PB6: J9.5
PB7: J9.6
PB8: J7.9
PB9: J7.8
PB10: J8.3
PB11: J8.2
PB12: J10.1
PB13: J10.2
PB14: J10.3
PB15: J10.4
PC13: J7.7
STM32_RSTn: J7.6

### Notes on the sheet
- CONNECTORS
- Mounting hole
- Fiducials
- CONFIDENTAL. Do not distribute.
- CLOCKS (CPU & PCIE)
- Variant:
- Checked by
- (in symbol SDTitleBlock) Title:; Page Contents:; Revision:; Size:; DWG NO; Date:; Sheet; of

### Library data of the parts
C16-C18 = C2012X7R1H104K085AA: as C7 on sheet [04] - MICROCONTROLLER; Supplier 1: Digi-Key; Manufacturer Part Number: C2012X7R1H104K085AA; Stock 1: 151003; Pricing 1: 1 = 0.17000, 10 = 0.11900, 100 = 0.05610, 500 = 0.03936, 1000 = 0.03258 (USD); RoHS: Yes; Mount: Surface Mount; Case/Package: 0805; Number of Pins: 2; Weight: 0.000194oz; Case Code (Metric): 2012; Case Code (Imperial): 0805; Min Operating Temperature: -55°C; Max Operating Temperature: 125°C; Tolerance: 10%; Dielectric: X7R; Termination: SMD/SMT; Voltage Rating: 50V; Packaging: Tape and Reel; Voltage Rating (DC): 50V; Composition: Ceramic; Voltage: 50V; Package Quantity: 1; Length: 2mm; Height: 0.85mm; Depth: 1.25mm; Thickness: 0.037inch; Width: 0.049inch; Radiation Hardening: No; Lead Free: Lead Free; REACH SVHC: No SVHC; ComponentLink1URL: https://datasheet.ciiva.com/11788/0900766b80c1bb00-11788128.pdf?src-supplier=RSComponents; ComponentLink1Description: https://datasheet.ciiva.com/11788/0900766b80c1bb00-11788128.pdf?src-supplier=RSComponents; ComponentLink2URL: https://datasheet.ciiva.com/6250/tdkmlcccaprange-6250821.pdf?src-supplier=Digi-Key; ComponentLink2Description: https://datasheet.ciiva.com/6250/tdkmlcccaprange-6250821.pdf?src-supplier=Digi-Key; ComponentLink3URL: https://datasheet.ciiva.com/24191/e412-c-24191447.pdf?src-supplier=Future+Electronics; ComponentLink3Description: https://datasheet.ciiva.com/24191/e412-c-24191447.pdf?src-supplier=Future+Electronics; ComponentLink4URL: https://datasheet.ciiva.com/6250/tdkmlcccaprange-6250824.pdf?src-supplier=Digi-Key; ComponentLink4Description: https://datasheet.ciiva.com/6250/tdkmlcccaprange-6250824.pdf?src-supplier=Digi-Key; ComponentLink5URL: https://datasheet.ciiva.com/23803/1796654-23803035.pdf?src-supplier=Newark; ComponentLink5Description: https://datasheet.ciiva.com/23803/1796654-23803035.pdf?src-supplier=Newark; ComponentLink6URL: https://datasheet.ciiva.com/28602/1571323-28602204.pdf?src-supplier=Element14; ComponentLink6Description: https://datasheet.ciiva.com/28602/1571323-28602204.pdf?src-supplier=Element14; Supplier Part Number 1: 445-7534-1-ND
FID1-FID4 = FID_1MMC: Fiducial 40mil Diameter, 120mil Mask
J7 J8 = M20-7821046: Manufacturer: Harwin; Number of Contacts: 10; Connector Type: Receptacle,Socket; Gender: Receptacle; Insulation Resistance: 1MR; Max Current Rating: 3A; Contact Resistance: 20mR; Mating Cycles: 50; Hole Diameter: 0.8mm; Supplier 1: Mouser; Manufacturer Part Number: M20-7821046; Stock 1: 412; Pricing 1: 1 = 1.27000, 10 = 1.08000, 100 = 0.93800, 500 = 0.79100, 1000 = 0.70400, 2500 = 0.61500 (USD); RoHS: Yes; Mount: Through Hole; Case/Package: SIL; Housing Color: Black; Color: Black; Contact Plating: Tin; Contact Material: Bronze; Housing Material: Polyamide; Min Operating Temperature: -40°C; Max Operating Temperature: 105°C; Termination: Solder; Number of Rows: 1; Orientation: Straight; Number of Positions: 10; Packaging: Rail/Tube; Contact Gender: Female; Package Quantity: 23; Current Rating: 3A; Length: 25.8mm; Pitch: 2.54mm; Depth: 2.5mm; Lead Pitch: 2.54mm; Radiation Hardening: No; REACH SVHC: No SVHC; ComponentLink1URL: https://datasheet.ciiva.com/26899/getdatasheetpartid-559226-26899379.pdf?src-supplier=Verical; ComponentLink1Description: https://datasheet.ciiva.com/26899/getdatasheetpartid-559226-26899379.pdf?src-supplier=Verical; ComponentLink2URL: https://datasheet.ciiva.com/11753/0900766b80dc1d2b-11753869.pdf?src-supplier=RSComponents; ComponentLink2Description: https://datasheet.ciiva.com/11753/0900766b80dc1d2b-11753869.pdf?src-supplier=RSComponents; ComponentLink3URL: https://datasheet.ciiva.com/6785/m20-782-6785605.pdf?src-supplier=Digi-Key; ComponentLink3Description: https://datasheet.ciiva.com/6785/m20-782-6785605.pdf?src-supplier=Digi-Key; ComponentLink4URL: https://datasheet.ciiva.com/10151/m20-782-10151366.pdf?src-supplier=Avnet; ComponentLink4Description: https://datasheet.ciiva.com/10151/m20-782-10151366.pdf?src-supplier=Avnet; ComponentLink5URL: https://datasheet.ciiva.com/16732/m20-782-16732152.pdf?src-supplier=Avnet+Europe; ComponentLink5Description: https://datasheet.ciiva.com/16732/m20-782-16732152.pdf?src-supplier=Avnet+Europe; Supplier Part Number 1: 855-M20-7821046
J9 J10 = M20-7820842: 08-WAY SIL VERT SOCKET L/FREE; Manufacturer: Harwin; Number of Contacts: 8; Connector Type: Receptacle,Socket; Gender: Female; Max Current Rating: 3A; Contact Resistance: 20mR; Supplier 1: Mouser; Manufacturer Part Number: M20-7820842; Stock 1: 1459; Pricing 1: 1 = 1.10000, 10 = 0.94000, 100 = 0.81200, 500 = 0.68500, 1000 = 0.60900, 2500 = 0.53300 (USD); RoHS: Yes; Mount: Through Hole; Case/Package: SIL; Weight: 0.025397oz; Contact Plating: Tin,Gold; Housing Color: Black; Color: Black; Contact Material: Bronze; Housing Material: Polyamide; Min Operating Temperature: -40°C; Max Operating Temperature: 105°C; Termination: Solder; Number of Rows: 1; Orientation: Straight; Number of Positions: 8; Contact Gender: Female; Package Quantity: 29; Packaging: Rail/Tube; Length: 20.72mm; Pitch: 2.54mm; Depth: 2.5mm; Radiation Hardening: No; ComponentLink1URL: https://datasheet.ciiva.com/16732/m20-782-16732663.pdf?src-supplier=Avnet+Europe; ComponentLink1Description: https://datasheet.ciiva.com/16732/m20-782-16732663.pdf?src-supplier=Avnet+Europe; ComponentLink2URL: https://datasheet.ciiva.com/9480/m20-782-9480074.pdf?src-supplier=Avnet; ComponentLink2Description: https://datasheet.ciiva.com/9480/m20-782-9480074.pdf?src-supplier=Avnet; Supplier Part Number 1: 855-M20-7820842
MH1-MH4 = MH_7.4MMC_3.2MMD

## Nets that join several sheets
+3V3: [03] - PWR IN (8 pins), [04] - MICROCONTROLLER (14 pins), [05] - CONNECTORS (6 pins)
GND: [03] - PWR IN (23 pins), [04] - MICROCONTROLLER (16 pins), [05] - CONNECTORS (11 pins)
PA0: [04] - MICROCONTROLLER (U3.10), [05] - CONNECTORS (J7.5)
PA1: [04] - MICROCONTROLLER (U3.11), [05] - CONNECTORS (J7.4)
PA2: [04] - MICROCONTROLLER (U3.12), [05] - CONNECTORS (J7.3)
PA3: [04] - MICROCONTROLLER (U3.13), [05] - CONNECTORS (J8.10)
PA4: [04] - MICROCONTROLLER (U3.14), [05] - CONNECTORS (J8.9)
PA5: [04] - MICROCONTROLLER (U3.15), [05] - CONNECTORS (J8.8)
PA6: [04] - MICROCONTROLLER (U3.16), [05] - CONNECTORS (J8.7)
PA7: [04] - MICROCONTROLLER (U3.17), [05] - CONNECTORS (J8.6)
PA8: [04] - MICROCONTROLLER (U3.29), [05] - CONNECTORS (J10.5)
PA9: [04] - MICROCONTROLLER (U3.30), [05] - CONNECTORS (J10.6)
PA10: [04] - MICROCONTROLLER (U3.31), [05] - CONNECTORS (J10.7)
PA11: [03] - PWR IN (J1.2 Z1.2), [04] - MICROCONTROLLER (U3.32)
PA12: [03] - PWR IN (J1.3 Z2.2), [04] - MICROCONTROLLER (U3.33)
PA15: [04] - MICROCONTROLLER (U3.38), [05] - CONNECTORS (J9.1)
PB0: [04] - MICROCONTROLLER (U3.18), [05] - CONNECTORS (J8.5)
PB1: [04] - MICROCONTROLLER (U3.19), [05] - CONNECTORS (J8.4)
PB3: [04] - MICROCONTROLLER (U3.39), [05] - CONNECTORS (J9.2)
PB4: [04] - MICROCONTROLLER (U3.40), [05] - CONNECTORS (J9.3)
PB5: [04] - MICROCONTROLLER (U3.41), [05] - CONNECTORS (J9.4)
PB6: [04] - MICROCONTROLLER (U3.42), [05] - CONNECTORS (J9.5)
PB7: [04] - MICROCONTROLLER (U3.43), [05] - CONNECTORS (J9.6)
PB8: [04] - MICROCONTROLLER (U3.45), [05] - CONNECTORS (J7.9)
PB9: [04] - MICROCONTROLLER (U3.46), [05] - CONNECTORS (J7.8)
PB10: [04] - MICROCONTROLLER (U3.21), [05] - CONNECTORS (J8.3)
PB11: [04] - MICROCONTROLLER (U3.22), [05] - CONNECTORS (J8.2)
PB12: [04] - MICROCONTROLLER (D3.1 U3.25), [05] - CONNECTORS (J10.1)
PB13: [04] - MICROCONTROLLER (U3.26), [05] - CONNECTORS (J10.2)
PB14: [04] - MICROCONTROLLER (U3.27), [05] - CONNECTORS (J10.3)
PB15: [04] - MICROCONTROLLER (U3.28), [05] - CONNECTORS (J10.4)
PC13: [04] - MICROCONTROLLER (U3.2), [05] - CONNECTORS (J7.7)
STM32_RSTn: [03] - PWR IN (U1.4), [04] - MICROCONTROLLER (U3.7), [05] - CONNECTORS (J7.6)